# EAGLE schematic nestWidget (EAGLE 7.3.0)

## Sheet 1 of 2
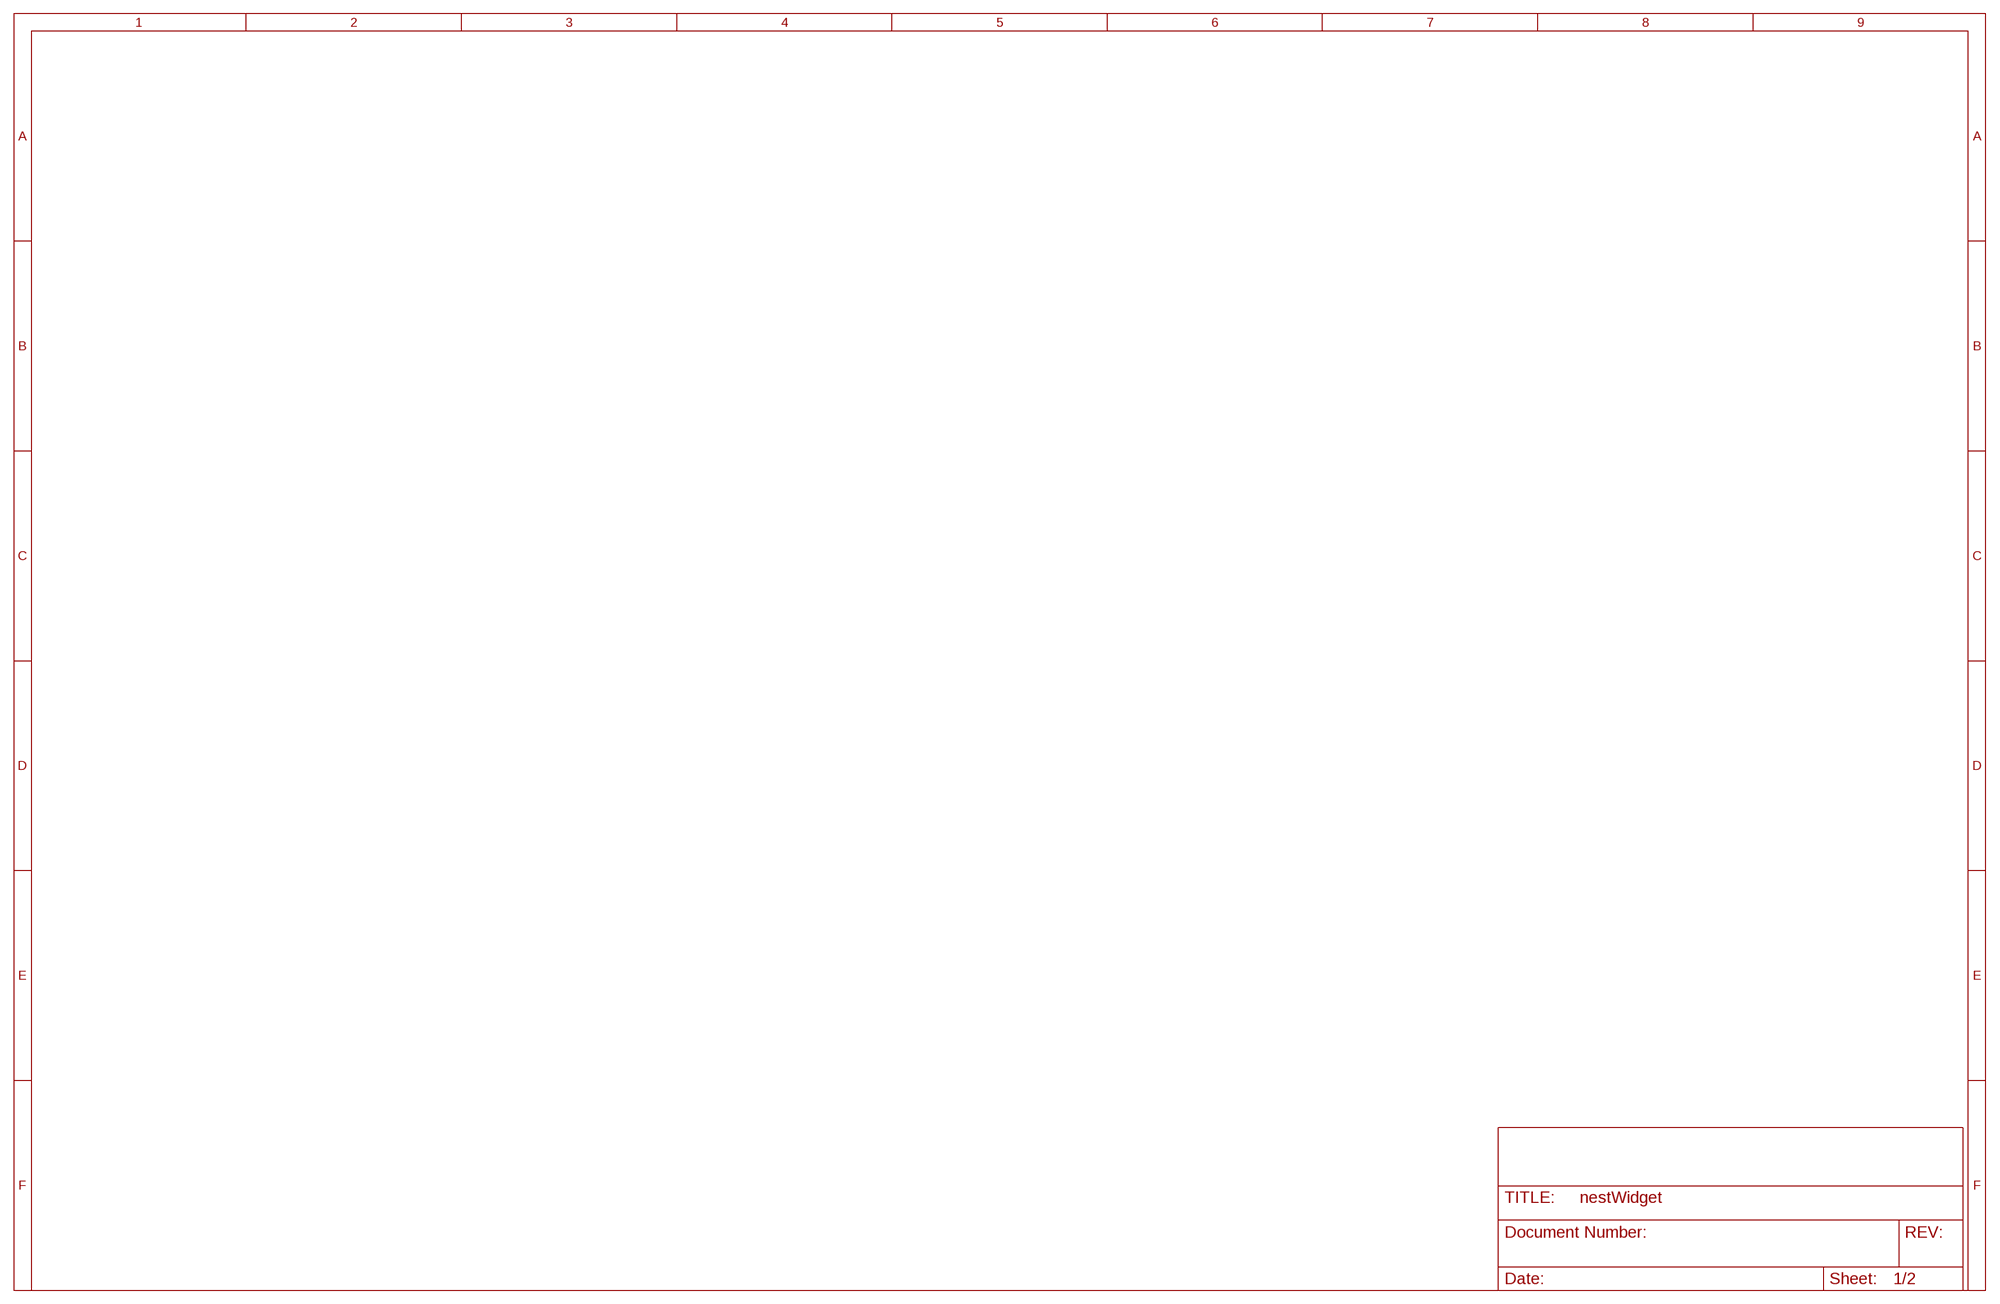
[diagram p0: schematic, sheet 1]

## Sheet 2 of 2
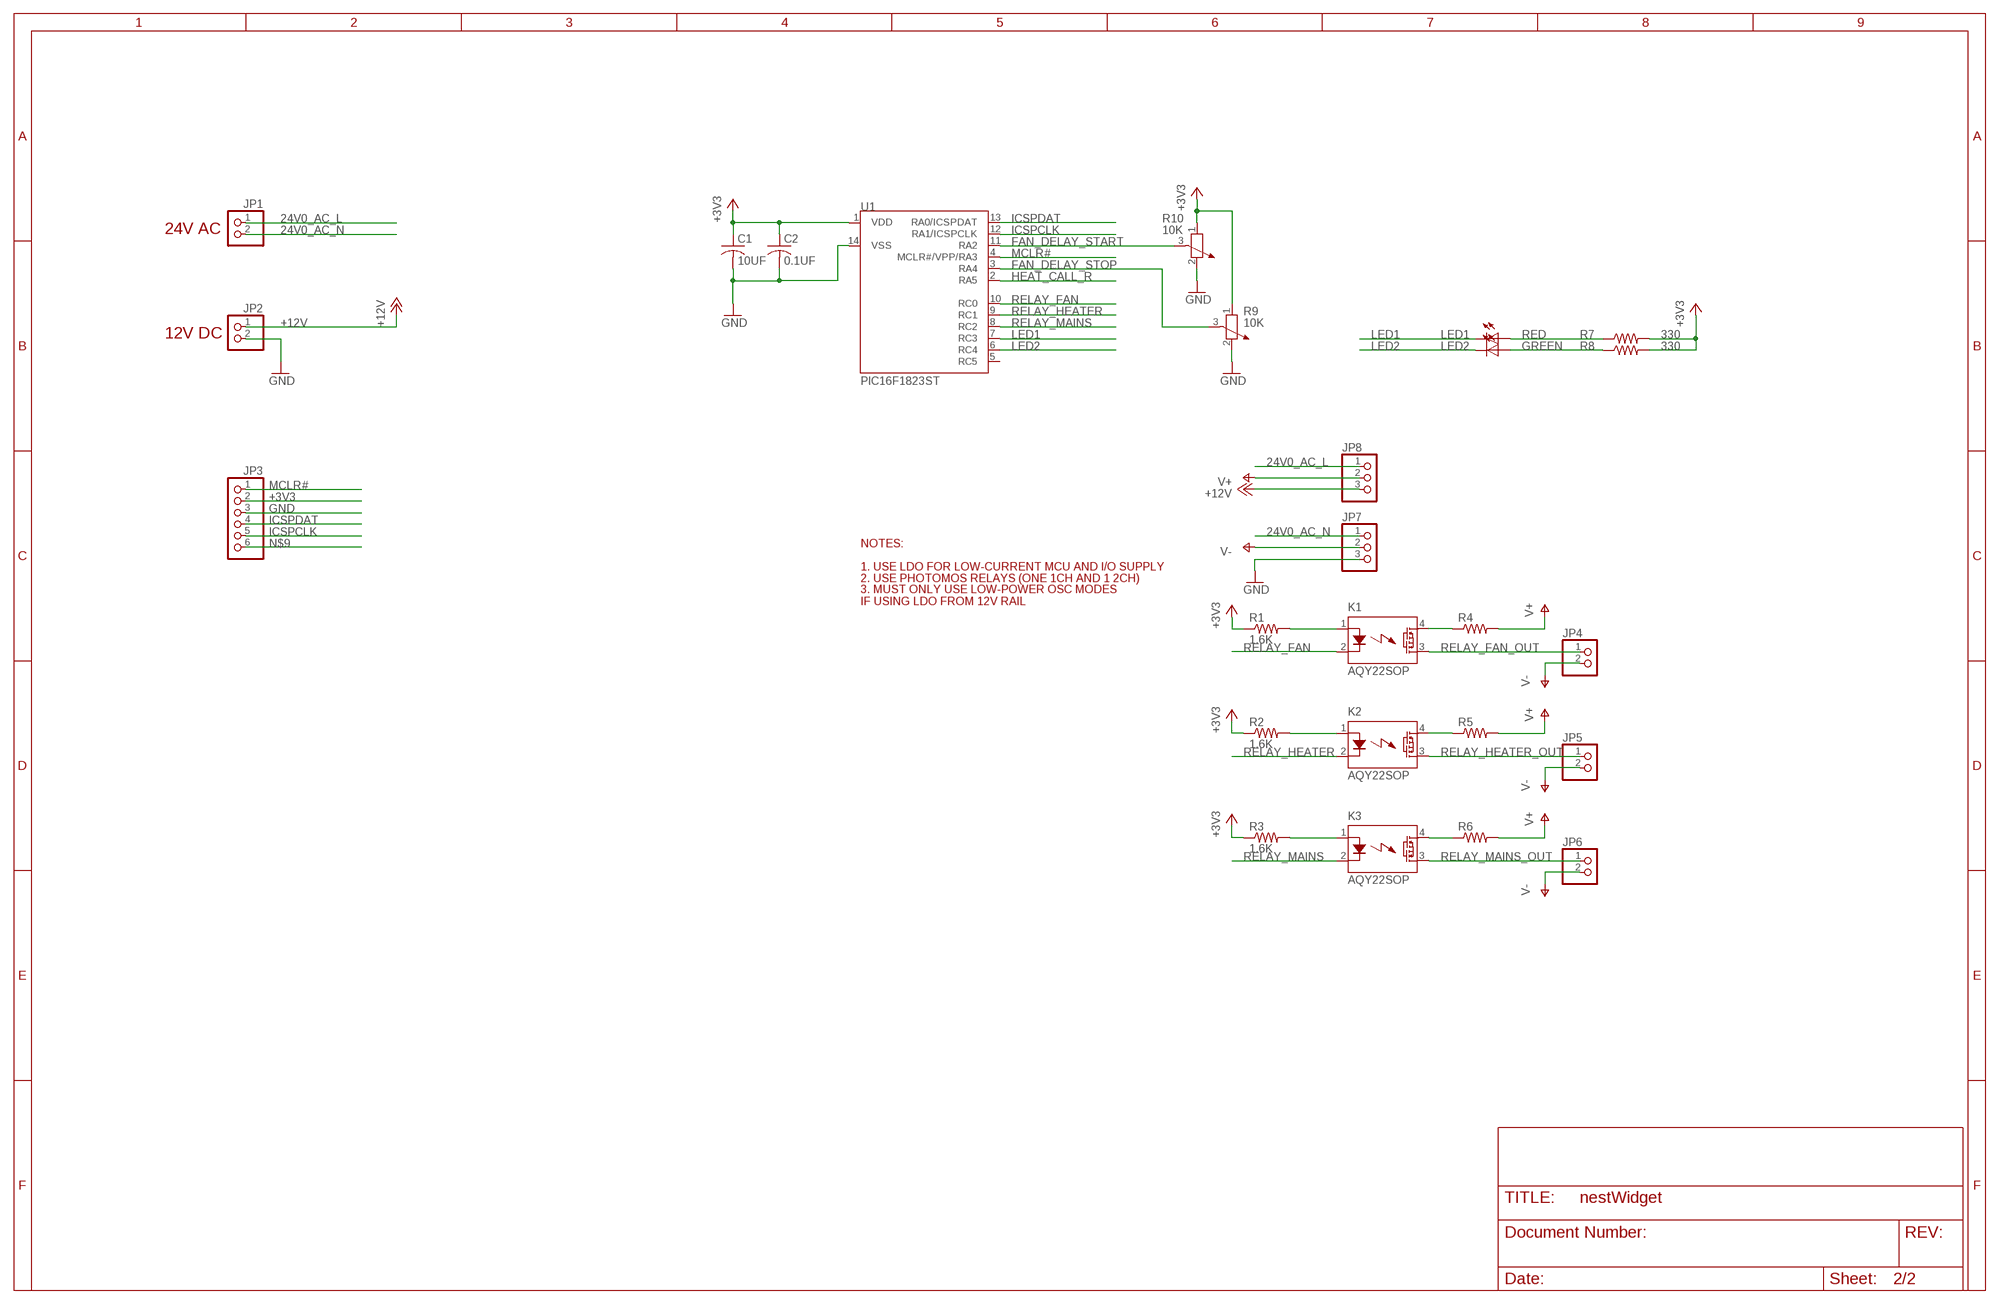
[diagram p1: schematic, sheet 2]

### Parts
C1  10UF  C-USC0603  [C0603]
C2  0.1UF  C-USC0603  [C0603]
JP1  PINHD-1X2  [1X02]
JP2  PINHD-1X2  [1X02]
JP3  PINHD-1X6  [1X06]
JP4  PINHD-1X2  [1X02]
JP5  PINHD-1X2  [1X02]
JP6  PINHD-1X2  [1X02]
JP7  PINHD-1X3  [1X03]
JP8  PINHD-1X3  [1X03]
K1  AQY22SOP  [SOP04]
K2  AQY22SOP  [SOP04]
K3  AQY22SOP  [SOP04]
LED1  RED  LEDCHIPLED_0603  [CHIPLED_0603]
LED2  GREEN  LEDCHIPLED_0603  [CHIPLED_0603]
R1  1.6K  R-US_R0603  [R0603]
R2  1.6K  R-US_R0603  [R0603]
R3  1.6K  R-US_R0603  [R0603]
R4  R-US_R0603  [R0603]
R5  R-US_R0603  [R0603]
R6  R-US_R0603  [R0603]
R7  330  R-US_R0603  [R0603]
R8  330  R-US_R0603  [R0603]
R9  10K  POTENTIOMETER_PT-10S  [PT-10S]
R10  10K  POTENTIOMETER_PT-10S  [PT-10S]
U1  PIC16F1823ST  [TSSOP14]

### Nets
24V0_AC_L: JP1.1 JP8.1
24V0_AC_N: JP1.2 JP7.1
+3V3: C1.1 C2.1 JP3.2 R1.1 R2.1 R3.1 R7.2 R8.2 R9.1 R10.1 U1.1(VDD)
+12V: JP2.1 JP8.3
FAN_DELAY_START: R10.3 U1.11(RA2)
FAN_DELAY_STOP: R9.3 U1.3(RA4)
GND: C1.2 C2.2 JP2.2 JP3.3 JP7.3 R9.2 R10.2 U1.14(VSS)
HEAT_CALL_R: U1.2(RA5)
ICSPCLK: JP3.5 U1.12(RA1/ICSPCLK)
ICSPDAT: JP3.4 U1.13(RA0/ICSPDAT)
LED1: LED1.C U1.7(RC3)
LED2: LED2.C U1.6(RC4)
MCLR#: JP3.1 U1.4(MCLR#/VPP/RA3)
N$1: K1.1(A) R1.2
N$2: K2.1(A) R2.2
N$3: K3.1(A) R3.2
N$4: K3.4(DS1) R6.1
N$5: K2.4(DS1) R5.1
N$6: K1.4(DS1) R4.1
N$9: JP3.6
N$11: LED1.A R7.1
N$12: LED2.A R8.1
RELAY_FAN: K1.2(K) U1.10(RC0)
RELAY_FAN_OUT: JP4.1 K1.3(DS2)
RELAY_HEATER: K2.2(K) U1.9(RC1)
RELAY_HEATER_OUT: JP5.1 K2.3(DS2)
RELAY_MAINS: K3.2(K) U1.8(RC2)
RELAY_MAINS_OUT: JP6.1 K3.3(DS2)
V+: JP8.2 R4.2 R5.2 R6.2
V-: JP4.2 JP5.2 JP6.2 JP7.2
Unconnected: U1.5(RC5)

### Notes on the sheet
- 24V AC
- 12V DC
- NOTES:
- 1. USE LDO FOR LOW-CURRENT MCU AND I/O SUPPLY
- 2. USE PHOTOMOS RELAYS (ONE 1CH AND 1 2CH)
- 3. MUST ONLY USE LOW-POWER OSC MODES
  IF USING LDO FROM 12V RAIL

## Library data of the parts
C1 C2 = rcl:C-US: CAPACITOR, American symbol
JP1 JP2 JP4-JP6 = pinhead:PINHD-1X2: PIN HEADER
JP3 = pinhead:PINHD-1X6: PIN HEADER
JP7 JP8 = pinhead:PINHD-1X3: PIN HEADER
K1-K3 = relay:AQY*: PhotoMOS Relay NAiS Source: http://www.panasonic-electric-works.com/catalogues/downloads/photomos/ds_x615_en_aqz10_20.pdf; OC_FARNELL: unknown; OC_NEWARK: unknown
LED1 LED2 = led:LED: LED OSRAM: - CHIPLED LG R971, LG N971, LY N971, LG Q971, LY Q971, LO R971, LY R971 LH N974, LH R974 LS Q976, LO Q976, LY Q976 LO Q996 - Hyper CHIPLED LW Q18S LB Q993, LB Q99A, LB R99A - SideLED LS A670, LO A670, LY A670, LG A670, LP A670 LB A673, LV A673, LT A673, LW A673 LH A674 LY A675 LS A676, LA A676, LO A676, LY A676, LW A676 LS A679, LY A679, LG A679 - Hyper Micro SIDELED® LS Y876, LA Y876, LO Y876, LY Y876 LT Y87S - SmartLED LW L88C, LW L88S LB L89C, LB L89S, LG L890 LS L89K, LO L89K, LY L89K LS L896, LA L896, LO L896, LY L896 - TOPLED LS T670, LO T670, LY T670, LG T670, LP T670 LSG T670, LSP T670, LSY T670, LOP T670, LYG T670 LG T671, LOG T671, LSG T671 LB T673, LV T673, LT T673, LW T673 LH T674 LS T676, LA T676, LO T676, LY T676, LB T676, LH T676, LSB T676, LW T676 LB T67C, LV T67C, LT T67C, LS T67K, LO T67K, LY T67K, LW E67C LS E67B, LA E67B, LO E67B, LY E67B, LB E67C, LV E67C, LT E67C LW T67C LS T679, LY T679, LG T679 LS T770, LO T770, LY T770, LG T770, LP T770 LB T773, LV T773, LT T773, LW T773 LH T774 LS E675, LA E675, LY E675, LS T675 LS T776, LA T776, LO T776, LY T776, LB T776 LHGB T686 LT T68C, LB T68C - Hyper Mini TOPLED® LB M676 - Mini TOPLED Santana® LG M470 LS M47K, LO M47K, LY M47K Source: http://www.osram.convergy.de LUXEON: - LUMILED® LXK2-PW12-R00, LXK2-PW12-S00, LXK2-PW14-U00, LXK2-PW14-V00 LXK2-PM12-R00, LXK2-PM12-S00, LXK2-PM14-U00 LXK2-PE12-Q00, LXK2-PE12-R00, LXK2-PE12-S00, LXK2-PE14-T00, LXK2-PE14-U00 LXK2-PB12-K00, LXK2-PB12-L00, LXK2-PB12-M00, LXK2-PB14-N00, LXK2-PB14-P00, LXK2-PB14-Q00 LXK2-PR12-L00, LXK2-PR12-M00, LXK2-PR14-Q00, LXK2-PR14-R00 LXK2-PD12-Q00, LXK2-PD12-R00, LXK2-PD12-S00 LXK2-PH12-R00, LXK2-PH12-S00 LXK2-PL12-P00, LXK2-PL12-Q00, LXK2-PL12-R00 Source: www.luxeon.com KINGBRIGHT: KA-3528ASYC Source: www.kingbright.com
R1-R8 = rcl:R-US_: RESISTOR, American symbol
R9 R10 = rcl:POTENTIOMETER_: Potentiometer
U1 = nestWidget:PIC16F1823